# Altium schematic sheet Component_Part2.SchDoc
size A; SheetNumber: 2; SheetTotal: 2
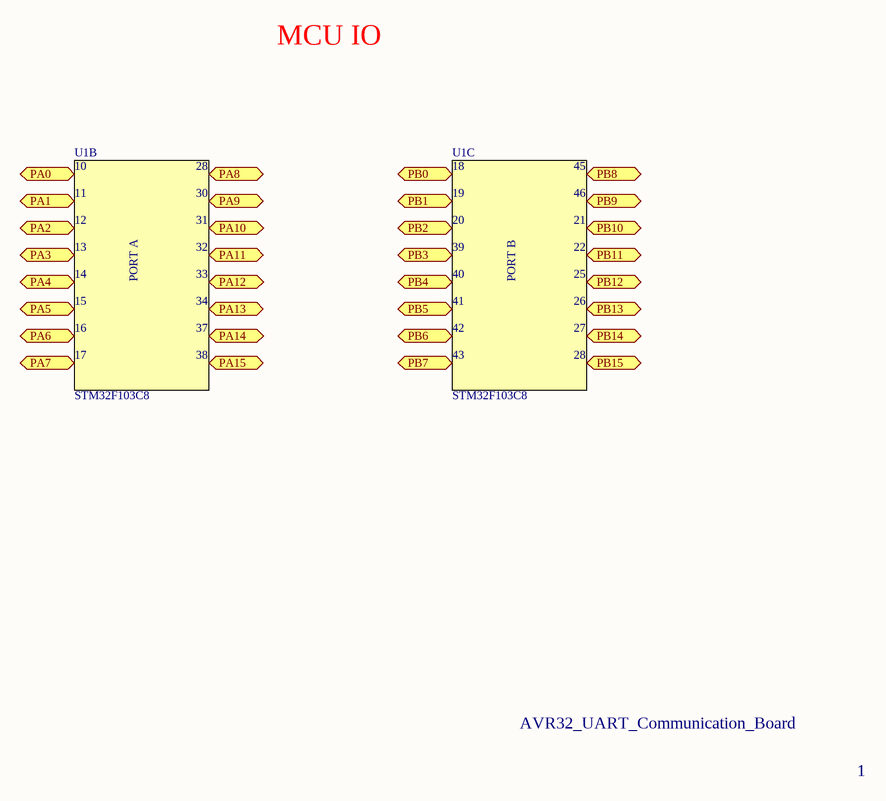
[diagram p0: Component_Part2.SchDoc]

## Ports
PA0 (bidir), PA1 (bidir), PA2 (bidir), PA3 (bidir), PA4 (bidir), PA5 (bidir), PA6 (bidir), PA7 (bidir), PA8 (bidir), PA9 (bidir), PA10 (bidir), PA11 (bidir), PA12 (bidir), PA13 (bidir), PA14 (bidir), PA15 (bidir), PB0 (bidir), PB1 (bidir), PB2 (bidir), PB3 (bidir), PB4 (bidir), PB5 (bidir), PB6 (bidir), PB7 (bidir), PB8 (bidir), PB9 (bidir), PB10 (bidir), PB11 (bidir), PB12 (bidir), PB13 (bidir), PB14 (bidir), PB15 (bidir)

## Notes on the sheet
- MCU IO
- 10
- U1B
- 28
- 18
- U1C
- 45
- 11
- 12
- 13
- 30
- 31
- 32
- 19
- 20
- 39
- 46
- 21
- 22
- 14
- 15
- PORT A
- 33
- 34
- 40
- 41
- PORT B
- 25
- 26
- 16
- 17
- 37
- 38
- 42
- 43
- 27
- STM32F103C8
- AVR32_UART_Communication_Board
- 1